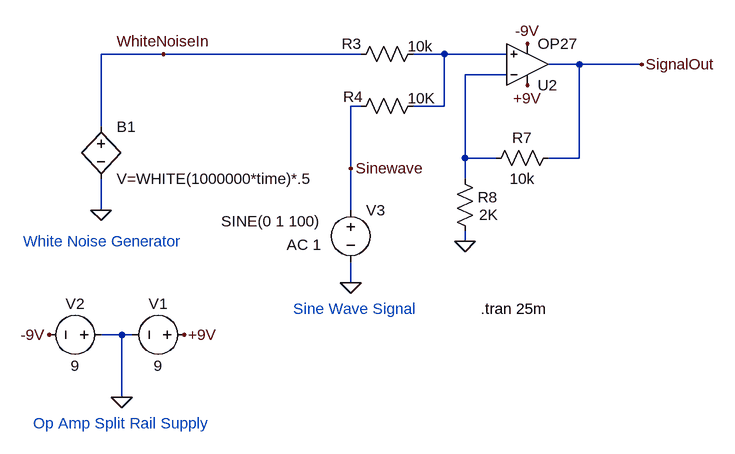
[diagram p0: schematic White_Noise_w_Sinewave_Summing.asc]
White_Noise_w_Sinewave_Summing.asc, the LTspice schematic file:
Version 4
SHEET 1 2908 1132
WIRE 1056 176 960 176
WIRE 1360 176 1056 176
WIRE 1488 176 1440 176
WIRE 1584 176 1488 176
WIRE 1696 192 1648 192
WIRE 1792 192 1696 192
WIRE 1584 208 1520 208
WIRE 1360 256 1344 256
WIRE 1488 256 1488 176
WIRE 1488 256 1440 256
WIRE 960 288 960 176
WIRE 1520 336 1520 208
WIRE 1568 336 1520 336
WIRE 1696 336 1696 192
WIRE 1696 336 1648 336
WIRE 1344 352 1344 256
WIRE 1520 368 1520 336
WIRE 960 416 960 368
WIRE 1344 416 1344 352
WIRE 1520 464 1520 448
WIRE 1344 528 1344 496
WIRE 992 608 960 608
WIRE 1008 608 992 608
WIRE 992 704 992 608
WIRE 992 704 976 704
FLAG 992 704 0
FLAG 1088 608 +9V
FLAG 880 608 -9V
FLAG 960 416 0
FLAG 1056 176 WhiteNoiseIn
FLAG 1792 192 SignalOut
FLAG 1616 160 -9V
FLAG 1616 224 +9V
FLAG 1520 464 0
FLAG 1344 528 0
FLAG 1344 352 Sinewave
SYMBOL voltage 1104 608 R90
WINDOW 0 -32 56 VBottom 2
WINDOW 3 32 56 VTop 2
SYMATTR InstName V1
SYMATTR Value 9
SYMBOL voltage 976 608 R90
WINDOW 0 -32 56 VBottom 2
WINDOW 3 32 56 VTop 2
SYMATTR InstName V2
SYMATTR Value 9
SYMBOL bv 960 272 R0
SYMATTR InstName B1
SYMATTR Value V=WHITE(1000000*time)*.5
SYMBOL res 1456 160 R90
WINDOW 0 16 110 VBottom 2
WINDOW 3 -12 5 VTop 2
SYMATTR InstName R3
SYMATTR Value 10k
SYMBOL res 1552 352 R270
WINDOW 0 32 56 VTop 2
WINDOW 3 0 56 VBottom 2
SYMATTR InstName R7
SYMATTR Value 10k
SYMBOL Opamps/OP27 1616 256 M180
SYMATTR InstName U2
SYMBOL res 1536 464 R180
WINDOW 0 -34 68 Left 2
WINDOW 3 -35 41 Left 2
SYMATTR InstName R8
SYMATTR Value 2K
SYMBOL voltage 1344 400 R0
WINDOW 3 -199 33 Left 2
WINDOW 123 -98 69 Left 2
SYMATTR InstName V3
SYMATTR Value SINE(0 1 100)
SYMATTR Value2 AC 1
SYMBOL res 1456 240 R90
WINDOW 0 17 108 VBottom 2
WINDOW 3 -12 3 VTop 2
SYMATTR InstName R4
SYMATTR Value 10K
TEXT 1544 568 Left 2 !.tran 25m
TEXT 856 744 Left 2 ;Op Amp Split Rail Supply
TEXT 1256 568 Left 2 ;Sine Wave Signal
TEXT 840 464 Left 2 ;White Noise Generator

The netlist it stands for:
* White_Noise_w_Sinewave_Summing.asc
V1 +9V 0 9
V2 0 -9V 9
B1 WhiteNoiseIn 0 V=WHITE(1000000*time)*.5
R3 N001 WhiteNoiseIn 10k
R7 N002 SignalOut 10k
XU2 N001 N002 +9V -9V SignalOut OP27  ; pins In+ In- V+ V- OUT
R8 0 N002 2K
V3 Sinewave 0 SINE(0 1 100) AC 1
R4 N001 Sinewave 10K
.tran 25m
* Op Amp Split Rail Supply
* Sine Wave Signal
* White Noise Generator
.lib ADI.lib
.backanno
.end